# EAGLE schematic Power_FM (EAGLE 5.11)

## Sheet 1 of 10
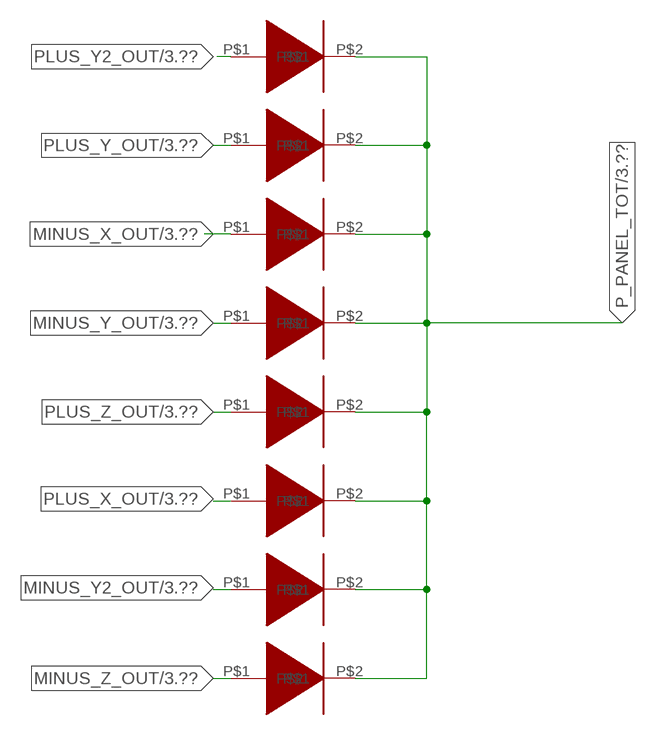
[diagram p0: schematic, sheet 1]

### Parts
D104  DIODE_FM  [DIODE_FM]
D105  DIODE_FM  [DIODE_FM]
D106  DIODE_FM  [DIODE_FM]
D107  DIODE_FM  [DIODE_FM]
D108  DIODE_FM  [DIODE_FM]
D109  DIODE_FM  [DIODE_FM]
D110  DIODE_FM  [DIODE_FM]
D111  DIODE_FM  [DIODE_FM]

### Nets
MINUS_X_OUT: D106.P$1 ; also sheet 3
MINUS_Y2_OUT: D110.P$1 ; also sheet 3
MINUS_Y_OUT: D107.P$1 ; also sheet 3
MINUS_Z_OUT: D111.P$1 ; also sheet 3
P_PANEL_TOT: D104.P$2 D105.P$2 D106.P$2 D107.P$2 D108.P$2 D109.P$2 D110.P$2 D111.P$2 ; also sheet 3
PLUS_X_OUT: D109.P$1 ; also sheet 3
PLUS_Y2_OUT: D104.P$1 ; also sheet 3
PLUS_Y_OUT: D105.P$1 ; also sheet 3
PLUS_Z_OUT: D108.P$1 ; also sheet 3

## Sheet 2 of 10
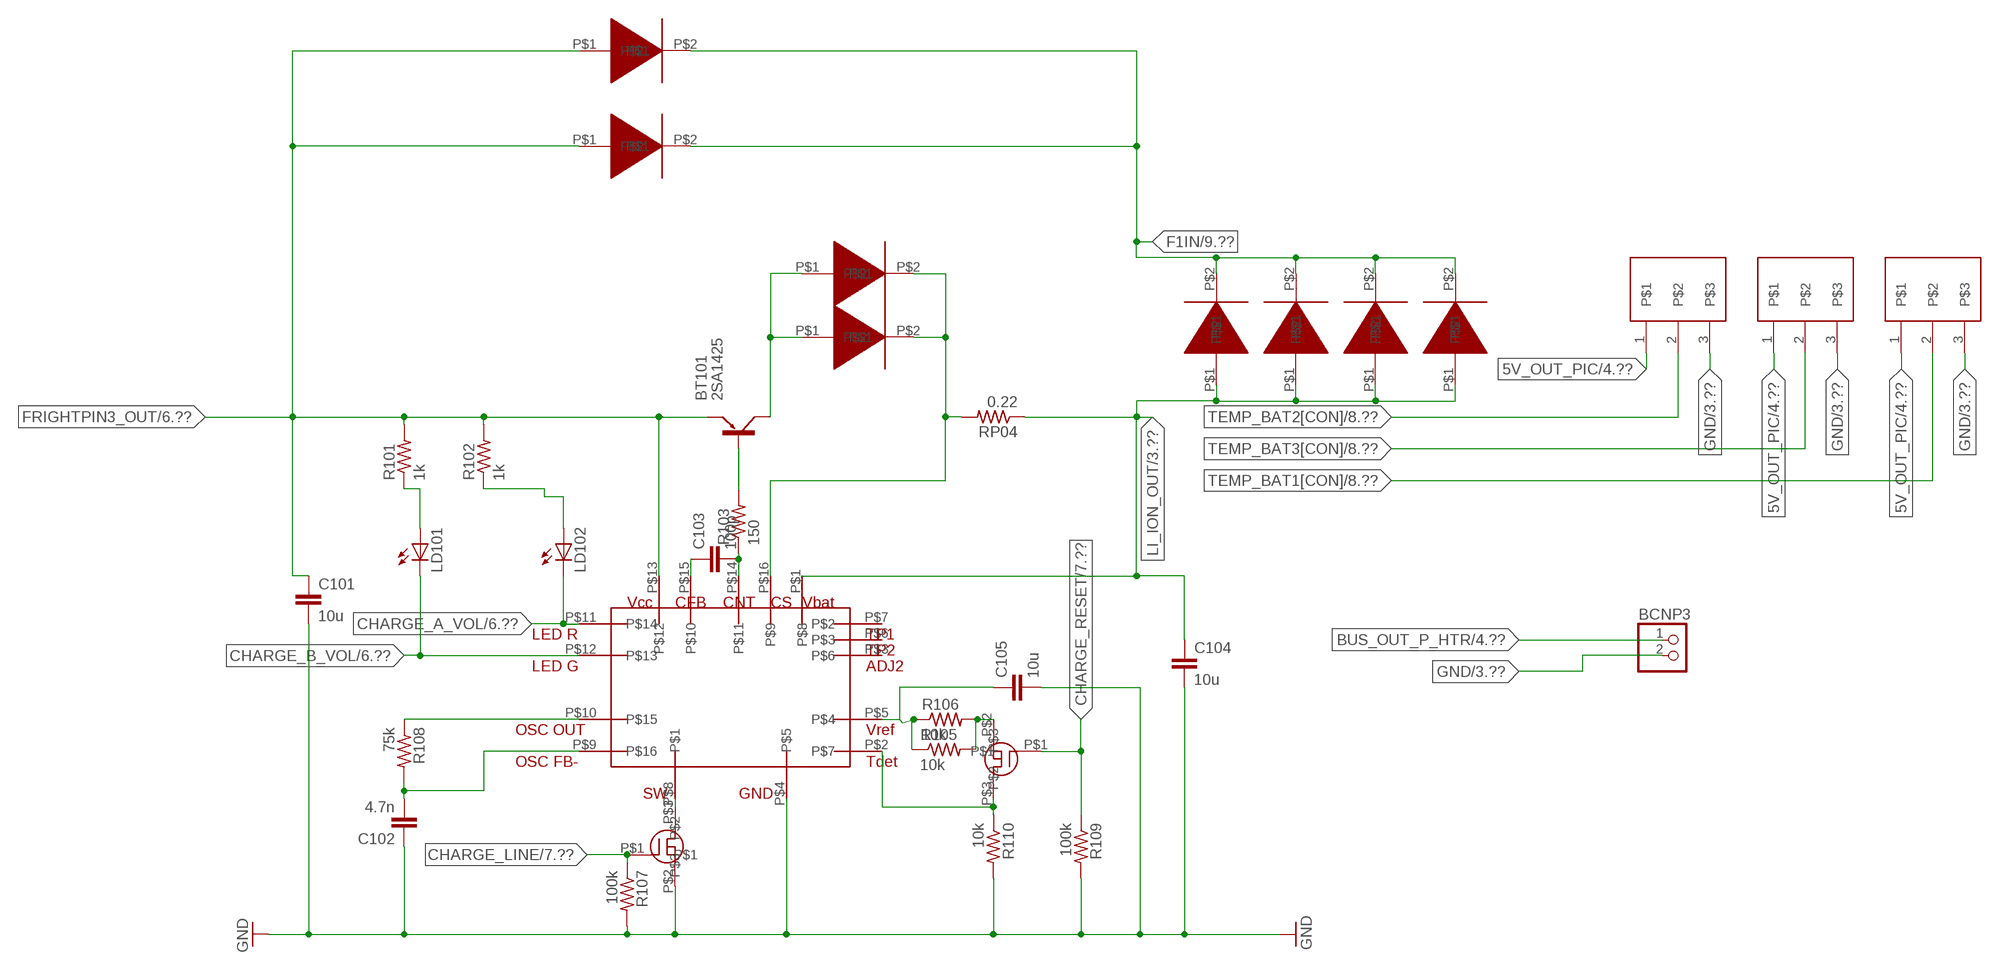
[diagram p1: schematic, sheet 2]

### Parts
BCNP3  PINHD-1X2  [1X02]
BCNP4  BAT_CON1  [BAT_CON1]
BCNP5  BAT_CON1  [BAT_CON1]
BCNP6  BAT_CON1  [BAT_CON1]
BT101  2SA1425  [2-7D101A]
C101  10u  C-EUC0603  [C0603]
C102  4.7n  C-EUC0603  [C0603]
C103  100p  C-EUC0603  [C0603]
C104  10u  C-EUC0603  [C0603]
C105  10u  C-EUC0603  [C0603]
CHARGE_IC  MM1639  [MM1639]
D101  DIODE_FM  [DIODE_FM]
D102  DIODE_FM  [DIODE_FM]
D103  DIODE_FM  [DIODE_FM]
D112  DIODE_FM  [DIODE_FM]
D114  DIODE_FM  [DIODE_FM]
D115  DIODE_FM  [DIODE_FM]
D116  DIODE_FM  [DIODE_FM]
D117  DIODE_FM  [DIODE_FM]
LD101  LED3MM  [LED3MM]
LD102  LED3MM  [LED3MM]
Q101  2SK1062  [2SK1062]
Q102  2SK1062  [2SK1062]
R101  1k  R-US_R0603  [R0603]
R102  1k  R-US_R0603  [R0603]
R103  150  R-US_R0603  [R0603]
R105  10k  R-US_R0603  [R0603]
R106  10k  R-US_R0603  [R0603]
R107  100k  R-US_R0603  [R0603]
R108  75k  R-US_R0603  [R0603]
R109  100k  R-US_R0603  [R0603]
R110  10k  R-US_R0603  [R0603]
RP04  0.22  R-US_0207/15  [0207/15]

### Nets
5V_OUT_PIC: BCNP4.1 BCNP5.1 BCNP6.1 ; also sheet 4,6,7,8,9
BUS_OUT_P_HTR: BCNP3.1 ; also sheet 4
CHARGE_A_VOL: CHARGE_IC.P$11 LD102.K(C) ; also sheet 6
CHARGE_B_VOL: CHARGE_IC.P$12 LD101.K(C) ; also sheet 6
CHARGE_LINE: Q101.P$1 R107.1 ; also sheet 7
CHARGE_RESET: Q102.P$1 R109.1 ; also sheet 7
F1IN: D103.P$2 D112.P$2 D114.P$2 D115.P$2 D116.P$2 D117.P$2 ; also sheet 9
FRIGHTPIN3_OUT: BT101.P$3(E) C101.1 CHARGE_IC.P$13 D103.P$1 D112.P$1 R101.2 R102.2 ; also sheet 6,9
GND: BCNP3.2 BCNP4.3 BCNP5.3 BCNP6.3 C101.2 C102.1 C104.2 C105.2 CHARGE_IC.P$4 Q101.P$2 R107.2 R109.2 R110.2 ; also sheet 3,4,5,6,7,8,9,10
LI_ION_OUT: C104.1 CHARGE_IC.P$1 D114.P$1 D115.P$1 D116.P$1 D117.P$1 RP04.1 ; also sheet 3
N$2: LD101.A R101.1
N$4: LD102.A R102.1
N$5: C102.2 CHARGE_IC.P$9 R108.2
N$6: CHARGE_IC.P$10 R108.1
N$8: CHARGE_IC.P$2 Q102.P$3 R110.1
N$9: C105.1 CHARGE_IC.P$5 R105.1 R106.1
N$10: Q102.P$2 R105.2 R106.2
N$12: BT101.P$2(C) D101.P$1 D102.P$1
N$13: C103.2 CHARGE_IC.P$14 R103.1
N$14: C103.1 CHARGE_IC.P$15
N$17: CHARGE_IC.P$8 Q101.P$3
N$19: CHARGE_IC.P$16 D101.P$2 D102.P$2 RP04.2
N$92: BT101.P$1(B) R103.2
TEMP_BAT1[CON]: BCNP5.2 ; also sheet 8
TEMP_BAT2[CON]: BCNP6.2 ; also sheet 8
TEMP_BAT3[CON]: BCNP4.2 ; also sheet 8
Unconnected: CHARGE_IC.P$3 CHARGE_IC.P$6 CHARGE_IC.P$7

## Sheet 3 of 10
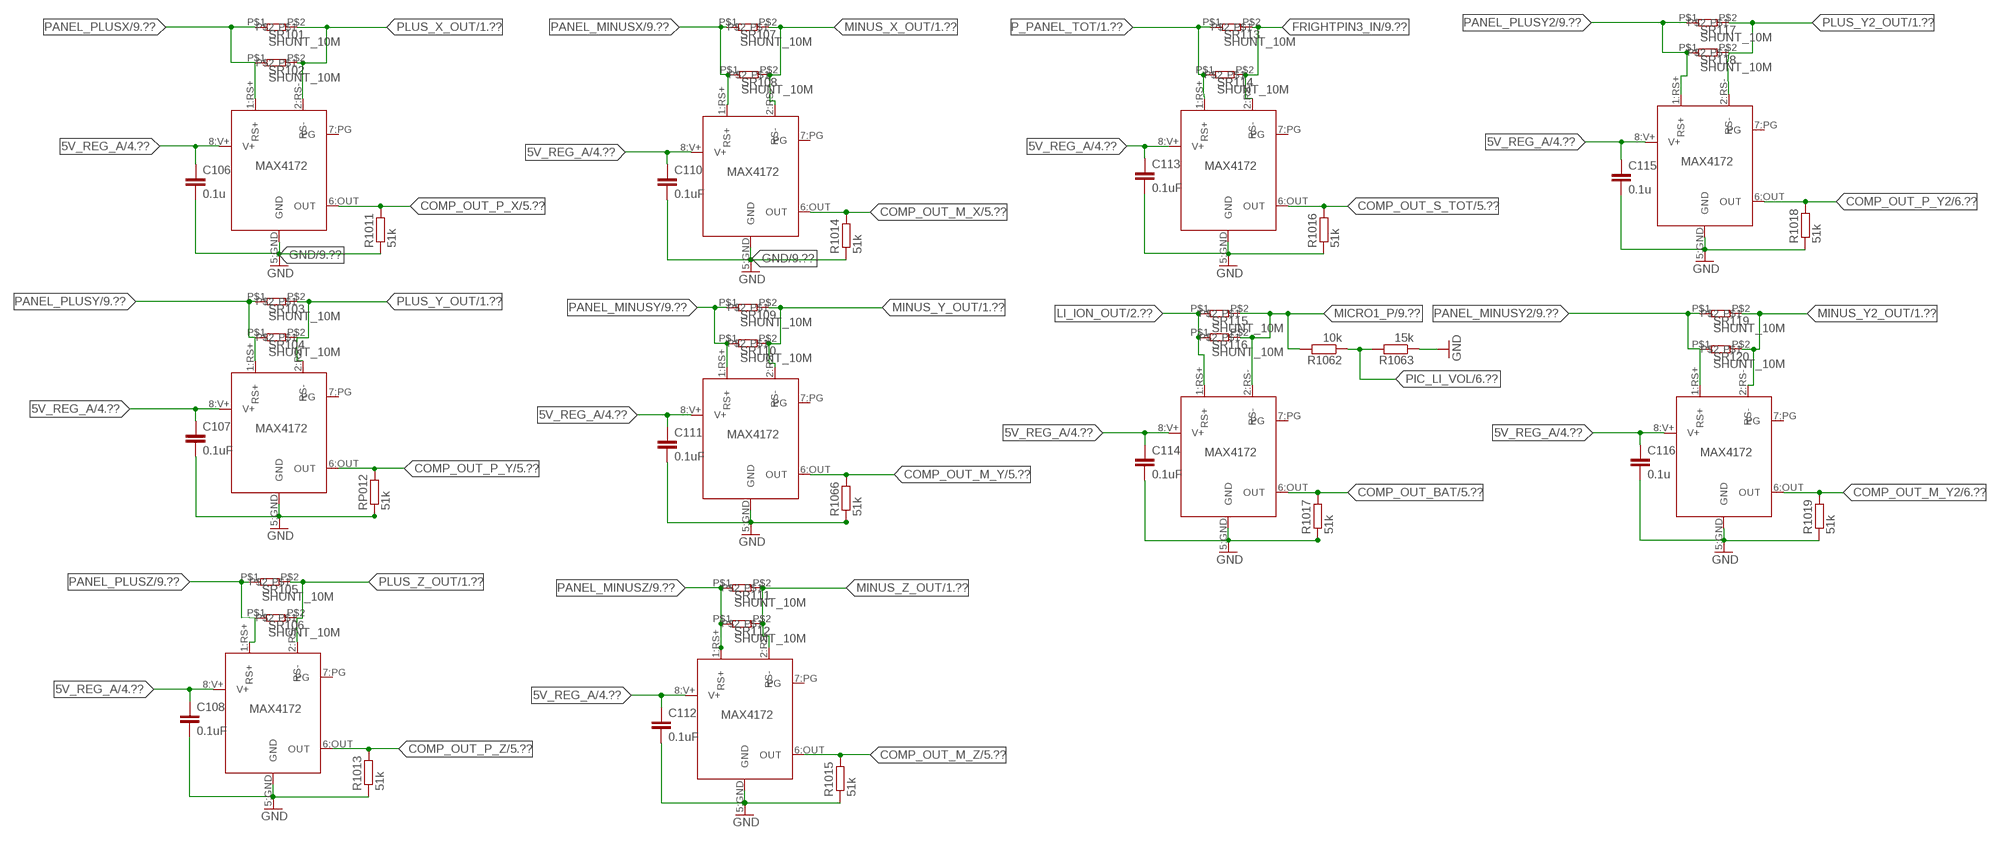
[diagram p2: schematic, sheet 3]

### Parts
C106  0.1u  C-EUC0603  [C0603]
C107  0.1uF  C-EUC0603  [C0603]
C108  0.1uF  C-EUC0603  [C0603]
C110  0.1uF  C-EUC0603  [C0603]
C111  0.1uF  C-EUC0603  [C0603]
C112  0.1uF  C-EUC0603  [C0603]
C113  0.1uF  C-EUC0603  [C0603]
C114  0.1uF  C-EUC0603  [C0603]
C115  0.1u  C-EUC0603  [C0603]
C116  0.1u  C-EUC0603  [C0603]
LI  MAX4172  [MAX4172]
M_X  MAX4172  [MAX4172]
M_Y  MAX4172  [MAX4172]
M_Y"  MAX4172  [MAX4172]
M_Z  MAX4172  [MAX4172]
P_X  MAX4172  [MAX4172]
P_Y  MAX4172  [MAX4172]
P_Y"  MAX4172  [MAX4172]
P_Z  MAX4172  [MAX4172]
R1011  51k  R-EU_R0603  [R0603]
R1013  51k  R-EU_R0603  [R0603]
R1014  51k  R-EU_R0603  [R0603]
R1015  51k  R-EU_R0603  [R0603]
R1016  51k  R-EU_R0603  [R0603]
R1017  51k  R-EU_R0603  [R0603]
R1018  51k  R-EU_R0603  [R0603]
R1019  51k  R-EU_R0603  [R0603]
R1062  10k  R-EU_R0603  [R0603]
R1063  15k  R-EU_R0603  [R0603]
R1066  51k  R-EU_R0603  [R0603]
RP012  51k  R-EU_R0603  [R0603]
SR101  SHUNT_10M  [SHUNT]
SR102  SHUNT_10M  [SHUNT]
SR103  SHUNT_10M  [SHUNT]
SR104  SHUNT_10M  [SHUNT]
SR105  SHUNT_10M  [SHUNT]
SR106  SHUNT_10M  [SHUNT]
SR107  SHUNT_10M  [SHUNT]
SR108  SHUNT_10M  [SHUNT]
SR109  SHUNT_10M  [SHUNT]
SR110  SHUNT_10M  [SHUNT]
SR111  SHUNT_10M  [SHUNT]
SR112  SHUNT_10M  [SHUNT]
SR113  SHUNT_10M  [SHUNT]
SR114  SHUNT_10M  [SHUNT]
SR115  SHUNT_10M  [SHUNT]
SR116  SHUNT_10M  [SHUNT]
SR117  SHUNT_10M  [SHUNT]
SR118  SHUNT_10M  [SHUNT]
SR119  SHUNT_10M  [SHUNT]
SR120  SHUNT_10M  [SHUNT]
TOT  MAX4172  [MAX4172]

### Nets
5V_REG_A: C106.1 C107.1 C108.1 C110.1 C111.1 C112.1 C113.1 C114.1 C115.1 C116.1 LI.8:V+(V+) M_X.8:V+(V+) M_Y".8:V+(V+) M_Y.8:V+(V+) M_Z.8:V+(V+) P_X.8:V+(V+) P_Y".8:V+(V+) P_Y.8:V+(V+) P_Z.8:V+(V+) TOT.8:V+(V+) ; also sheet 4,5,6,7,10
COMP_OUT_BAT: LI.6:OUT(OUT) R1017.2 ; also sheet 5
COMP_OUT_M_X: M_X.6:OUT(OUT) R1014.2 ; also sheet 5
COMP_OUT_M_Y: M_Y.6:OUT(OUT) R1066.2 ; also sheet 5
COMP_OUT_M_Y2: M_Y".6:OUT(OUT) R1019.2 ; also sheet 6
COMP_OUT_M_Z: M_Z.6:OUT(OUT) R1015.2 ; also sheet 5
COMP_OUT_P_X: P_X.6:OUT(OUT) R1011.2 ; also sheet 5
COMP_OUT_P_Y: P_Y.6:OUT(OUT) RP012.2 ; also sheet 5
COMP_OUT_P_Y2: P_Y".6:OUT(OUT) R1018.2 ; also sheet 6
COMP_OUT_P_Z: P_Z.6:OUT(OUT) R1013.2 ; also sheet 5
COMP_OUT_S_TOT: R1016.2 TOT.6:OUT(OUT) ; also sheet 5
FRIGHTPIN3_IN: SR113.P$2 SR114.P$2 TOT.2:RS-(RS-) ; also sheet 9
GND: C106.2 C107.2 C108.2 C110.2 C111.2 C112.2 C113.2 C114.2 C115.2 C116.2 LI.5:GND(GND) M_X.5:GND(GND) M_Y".5:GND(GND) M_Y.5:GND(GND) M_Z.5:GND(GND) P_X.5:GND(GND) P_Y".5:GND(GND) P_Y.5:GND(GND) P_Z.5:GND(GND) R1011.1 R1013.1 R1014.1 R1015.1 R1016.1 R1017.1 R1018.1 R1019.1 R1063.1 R1066.1 RP012.1 TOT.5:GND(GND) ; also sheet 2,4,5,6,7,8,9,10
LI_ION_OUT: LI.1:RS+(RS+) SR115.P$1 SR116.P$1 ; also sheet 2
MICRO1_P: LI.2:RS-(RS-) R1062.2 SR115.P$2 SR116.P$2 ; also sheet 9
MINUS_X_OUT: M_X.2:RS-(RS-) SR107.P$2 SR108.P$2 ; also sheet 1
MINUS_Y2_OUT: M_Y".2:RS-(RS-) SR119.P$2 SR120.P$2 ; also sheet 1
MINUS_Y_OUT: M_Y.2:RS-(RS-) SR109.P$2 SR110.P$2 ; also sheet 1
MINUS_Z_OUT: M_Z.2:RS-(RS-) SR111.P$2 SR112.P$2 ; also sheet 1
P_PANEL_TOT: SR113.P$1 SR114.P$1 TOT.1:RS+(RS+) ; also sheet 1
PANEL_MINUSX: M_X.1:RS+(RS+) SR107.P$1 SR108.P$1 ; also sheet 9
PANEL_MINUSY: M_Y.1:RS+(RS+) SR109.P$1 SR110.P$1 ; also sheet 9
PANEL_MINUSY2: M_Y".1:RS+(RS+) SR119.P$1 SR120.P$1 ; also sheet 9
PANEL_MINUSZ: M_Z.1:RS+(RS+) SR111.P$1 SR112.P$1 ; also sheet 9
PANEL_PLUSX: P_X.1:RS+(RS+) SR101.P$1 SR102.P$1 ; also sheet 9
PANEL_PLUSY: P_Y.1:RS+(RS+) SR103.P$1 SR104.P$1 ; also sheet 9
PANEL_PLUSY2: P_Y".1:RS+(RS+) SR117.P$1 SR118.P$1 ; also sheet 9
PANEL_PLUSZ: P_Z.1:RS+(RS+) SR105.P$1 SR106.P$1 ; also sheet 9
PIC_LI_VOL: R1062.1 R1063.2 ; also sheet 6
PLUS_X_OUT: P_X.2:RS-(RS-) SR101.P$2 SR102.P$2 ; also sheet 1
PLUS_Y2_OUT: P_Y".2:RS-(RS-) SR117.P$2 SR118.P$2 ; also sheet 1
PLUS_Y_OUT: P_Y.2:RS-(RS-) SR103.P$2 SR104.P$2 ; also sheet 1
PLUS_Z_OUT: P_Z.2:RS-(RS-) SR105.P$2 SR106.P$2 ; also sheet 1
Unconnected: LI.7:PG(PG) M_X.7:PG(PG) M_Y".7:PG(PG) M_Y.7:PG(PG) M_Z.7:PG(PG) P_X.7:PG(PG) P_Y".7:PG(PG) P_Y.7:PG(PG) P_Z.7:PG(PG) TOT.7:PG(PG)

## Sheet 4 of 10
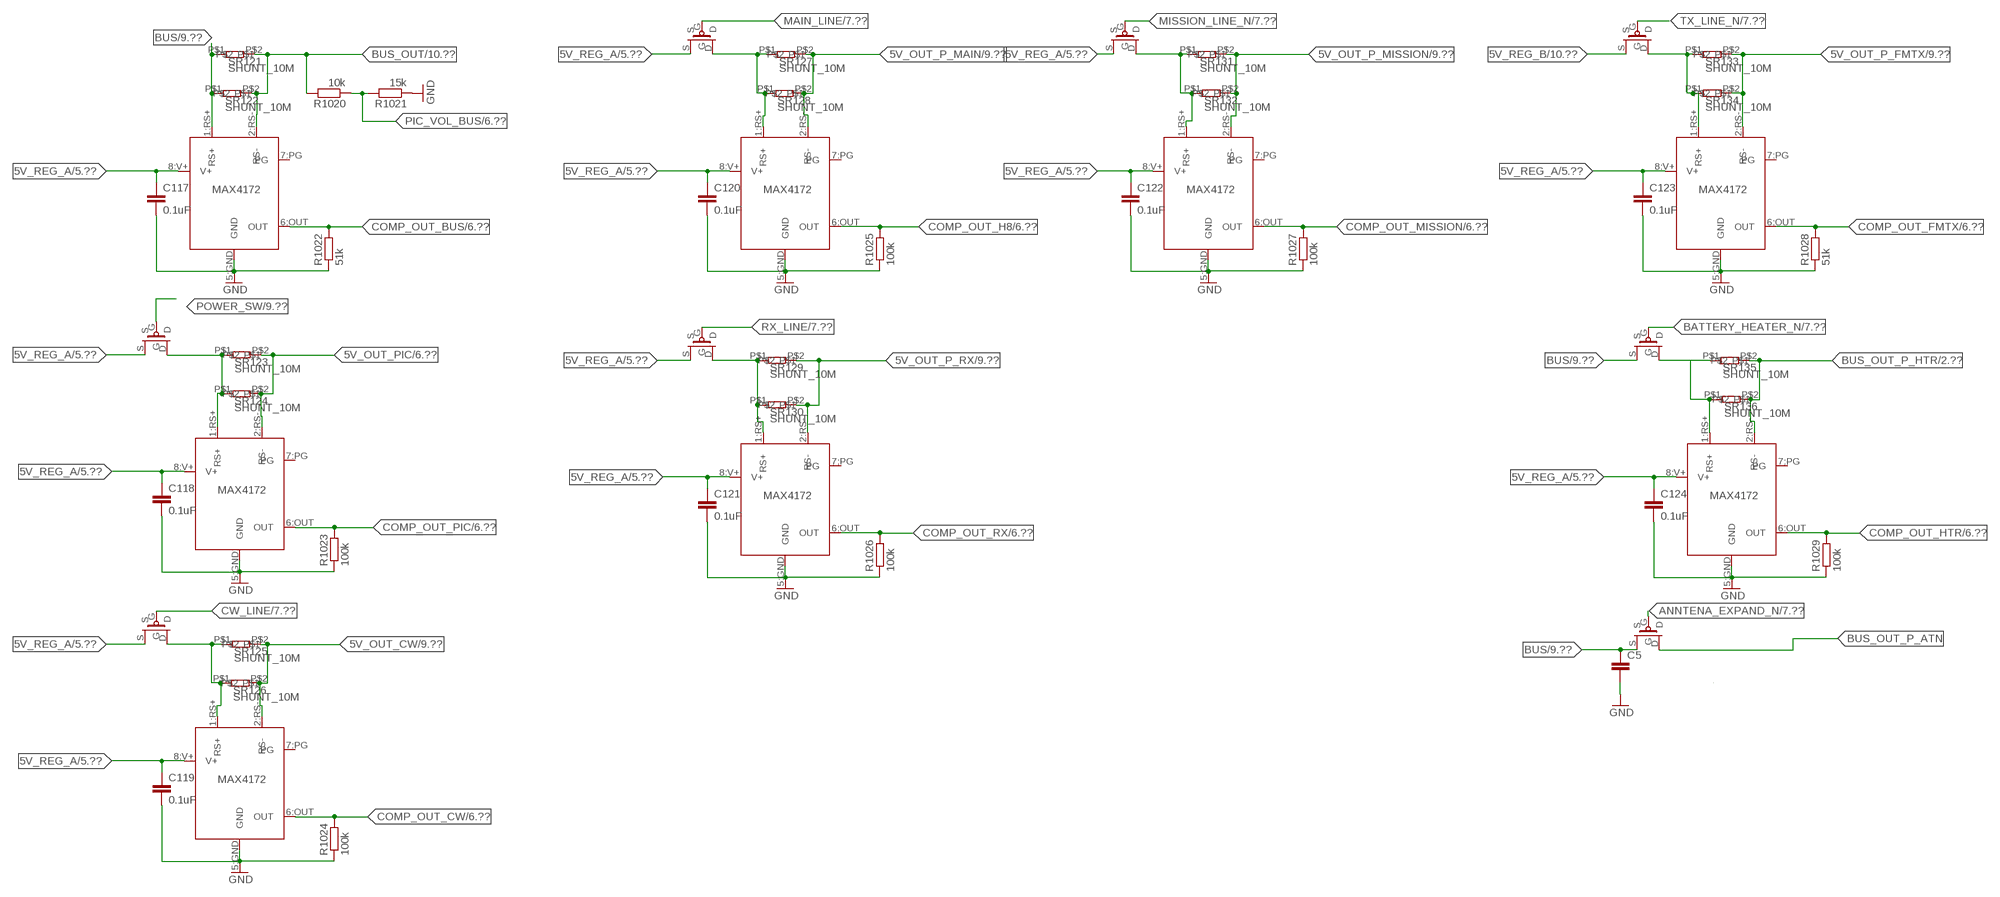
[diagram p3: schematic, sheet 4]

### Parts
C5  C-EUC1210  [C1210]
C117  0.1uF  C-EUC0603  [C0603]
C118  0.1uF  C-EUC0603  [C0603]
C119  0.1uF  C-EUC0603  [C0603]
C120  0.1uF  C-EUC0603  [C0603]
C121  0.1uF  C-EUC0603  [C0603]
C122  0.1uF  C-EUC0603  [C0603]
C123  0.1uF  C-EUC0603  [C0603]
C124  0.1uF  C-EUC0603  [C0603]
P_CW  MAX4172  [MAX4172]
P_H8  MAX4172  [MAX4172]
P_HTR  MAX4172  [MAX4172]
P_MISSION  MAX4172  [MAX4172]
P_PIC  MAX4172  [MAX4172]
P_REG  MAX4172  [MAX4172]
P_RX  MAX4172  [MAX4172]
P_TX  MAX4172  [MAX4172]
Q103  2SJ377  [2SJ377]
Q104  2SJ377  [2SJ377]
Q105  2SJ377  [2SJ377]
Q106  2SJ377  [2SJ377]
Q107  2SJ377  [2SJ377]
Q109  2SJ377  [2SJ377]
Q110  2SJ377  [2SJ377]
QP08  2SJ377  [2SJ377]
R1020  10k  R-EU_R0603  [R0603]
R1021  15k  R-EU_R0603  [R0603]
R1022  51k  R-EU_R0603  [R0603]
R1023  100k  R-EU_R0603  [R0603]
R1024  100k  R-EU_R0603  [R0603]
R1025  100k  R-EU_R0603  [R0603]
R1026  100k  R-EU_R0603  [R0603]
R1027  100k  R-EU_R0603  [R0603]
R1028  51k  R-EU_R0603  [R0603]
R1029  100k  R-EU_R0603  [R0603]
SR121  SHUNT_10M  [SHUNT]
SR122  SHUNT_10M  [SHUNT]
SR123  SHUNT_10M  [SHUNT]
SR124  SHUNT_10M  [SHUNT]
SR125  SHUNT_10M  [SHUNT]
SR126  SHUNT_10M  [SHUNT]
SR127  SHUNT_10M  [SHUNT]
SR128  SHUNT_10M  [SHUNT]
SR129  SHUNT_10M  [SHUNT]
SR130  SHUNT_10M  [SHUNT]
SR131  SHUNT_10M  [SHUNT]
SR132  SHUNT_10M  [SHUNT]
SR133  SHUNT_10M  [SHUNT]
SR134  SHUNT_10M  [SHUNT]
SR135  SHUNT_10M  [SHUNT]
SR136  SHUNT_10M  [SHUNT]

### Nets
5V_OUT_CW: P_CW.2:RS-(RS-) SR125.P$2 SR126.P$2 ; also sheet 9
5V_OUT_P_FMTX: P_TX.2:RS-(RS-) SR133.P$2 SR134.P$2 ; also sheet 9
5V_OUT_P_MAIN: P_H8.2:RS-(RS-) SR127.P$2 SR128.P$2 ; also sheet 9
5V_OUT_P_MISSION: P_MISSION.2:RS-(RS-) SR131.P$2 SR132.P$2 ; also sheet 9
5V_OUT_P_RX: P_RX.2:RS-(RS-) SR129.P$2 SR130.P$2 ; also sheet 9
5V_OUT_PIC: P_PIC.2:RS-(RS-) SR123.P$2 SR124.P$2 ; also sheet 2,6,7,8,9
5V_REG_A: C117.1 C118.1 C119.1 C120.1 C121.1 C122.1 C123.1 C124.1 P_CW.8:V+(V+) P_H8.8:V+(V+) P_HTR.8:V+(V+) P_MISSION.8:V+(V+) P_PIC.8:V+(V+) P_REG.8:V+(V+) P_RX.8:V+(V+) P_TX.8:V+(V+) Q103.S Q104.S Q105.S Q106.S Q107.S ; also sheet 3,5,6,7,10
5V_REG_B: QP08.S ; also sheet 10
ANNTENA_EXPAND_N: Q110.G ; also sheet 7
BATTERY_HEATER_N: Q109.G ; also sheet 7
BUS: C5.1 P_REG.1:RS+(RS+) Q109.S Q110.S SR121.P$1 SR122.P$1 ; also sheet 9
BUS_OUT: P_REG.2:RS-(RS-) R1020.2 SR121.P$2 SR122.P$2 ; also sheet 10
BUS_OUT_P_ATN: Q110.D
BUS_OUT_P_HTR: P_HTR.2:RS-(RS-) SR135.P$2 SR136.P$2 ; also sheet 2
COMP_OUT_BUS: P_REG.6:OUT(OUT) R1022.2 ; also sheet 6
COMP_OUT_CW: P_CW.6:OUT(OUT) R1024.2 ; also sheet 6
COMP_OUT_FMTX: P_TX.6:OUT(OUT) R1028.2 ; also sheet 6
COMP_OUT_H8: P_H8.6:OUT(OUT) R1025.2 ; also sheet 6
COMP_OUT_HTR: P_HTR.6:OUT(OUT) R1029.2 ; also sheet 6
COMP_OUT_MISSION: P_MISSION.6:OUT(OUT) R1027.2 ; also sheet 6
COMP_OUT_PIC: P_PIC.6:OUT(OUT) R1023.2 ; also sheet 6
COMP_OUT_RX: P_RX.6:OUT(OUT) R1026.2 ; also sheet 6
CW_LINE: Q104.G ; also sheet 7
GND: C5.2 C117.2 C118.2 C119.2 C120.2 C121.2 C122.2 C123.2 C124.2 P_CW.5:GND(GND) P_H8.5:GND(GND) P_HTR.5:GND(GND) P_MISSION.5:GND(GND) P_PIC.5:GND(GND) P_REG.5:GND(GND) P_RX.5:GND(GND) P_TX.5:GND(GND) R1021.1 R1022.1 R1023.1 R1024.1 R1025.1 R1026.1 R1027.1 R1028.1 R1029.1 ; also sheet 2,3,5,6,7,8,9,10
MAIN_LINE: Q105.G ; also sheet 7
MISSION_LINE_N: Q107.G ; also sheet 7
N$3: P_PIC.1:RS+(RS+) Q103.D SR123.P$1 SR124.P$1
N$55: P_HTR.1:RS+(RS+) Q109.D SR135.P$1 SR136.P$1
N$56: P_CW.1:RS+(RS+) Q104.D SR125.P$1 SR126.P$1
N$70: P_H8.1:RS+(RS+) Q105.D SR127.P$1 SR128.P$1
N$77: P_RX.1:RS+(RS+) Q106.D SR129.P$1 SR130.P$1
N$91: P_MISSION.1:RS+(RS+) Q107.D SR131.P$1 SR132.P$1
N$98: P_TX.1:RS+(RS+) QP08.D SR133.P$1 SR134.P$1
PIC_VOL_BUS: R1020.1 R1021.2 ; also sheet 6
POWER_SW: Q103.G ; also sheet 9
RX_LINE: Q106.G ; also sheet 7
TX_LINE_N: QP08.G ; also sheet 7
Unconnected: P_CW.7:PG(PG) P_H8.7:PG(PG) P_HTR.7:PG(PG) P_MISSION.7:PG(PG) P_PIC.7:PG(PG) P_REG.7:PG(PG) P_RX.7:PG(PG) P_TX.7:PG(PG)

## Sheet 5 of 10
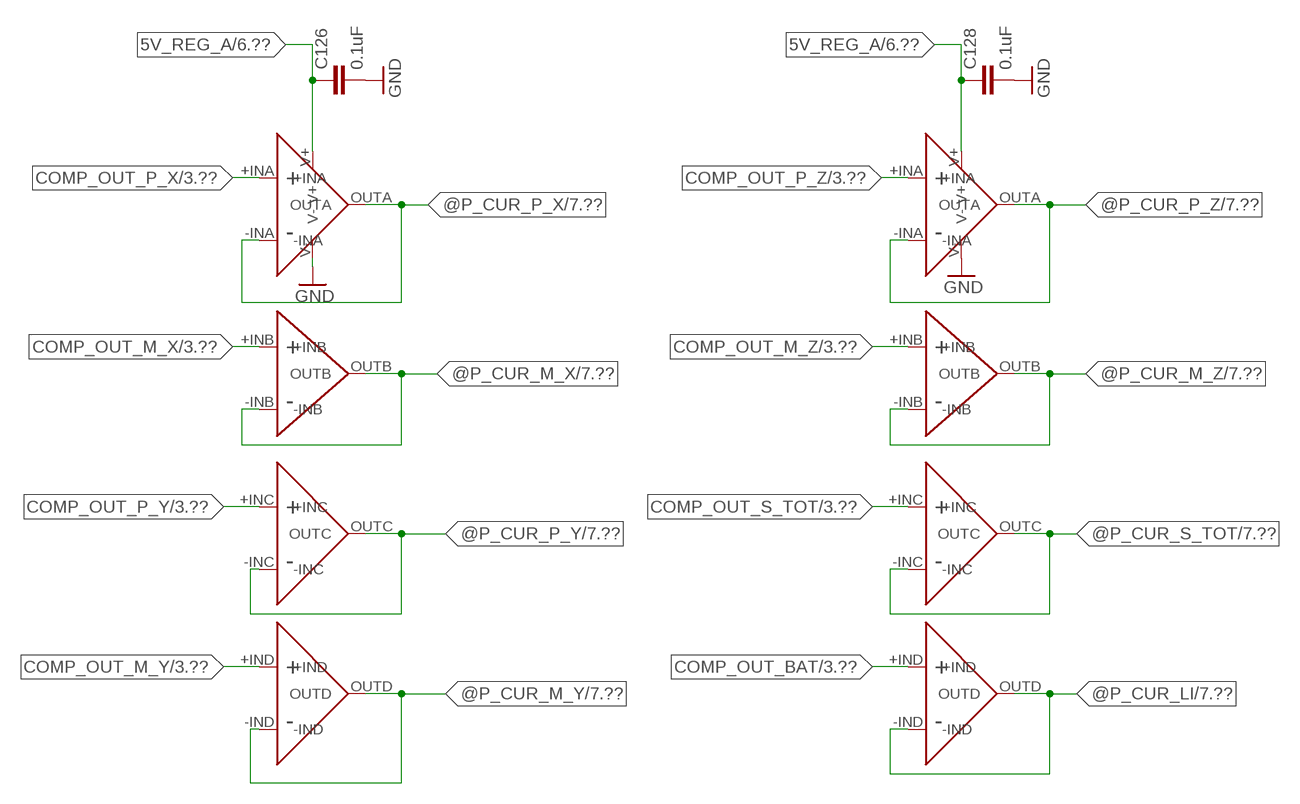
[diagram p4: schematic, sheet 5]

### Parts
AMP101  AD8554ARUZ  [AD8554ARUZ]
AMP102  AD8554ARUZ  [AD8554ARUZ]
C126  0.1uF  C-EUC0603  [C0603]
C128  0.1uF  C-EUC0603  [C0603]

### Nets
5V_REG_A: AMP101.V+ AMP102.V+ C126.1 C128.1 ; also sheet 3,4,6,7,10
@P_CUR_LI: AMP102.-IND AMP102.OUTD ; also sheet 7
@P_CUR_M_X: AMP101.-INB AMP101.OUTB ; also sheet 7
@P_CUR_M_Y: AMP101.-IND AMP101.OUTD ; also sheet 7
@P_CUR_M_Z: AMP102.-INB AMP102.OUTB ; also sheet 7
@P_CUR_P_X: AMP101.-INA AMP101.OUTA ; also sheet 7
@P_CUR_P_Y: AMP101.-INC AMP101.OUTC ; also sheet 7
@P_CUR_P_Z: AMP102.-INA AMP102.OUTA ; also sheet 7
@P_CUR_S_TOT: AMP102.-INC AMP102.OUTC ; also sheet 7
COMP_OUT_BAT: AMP102.+IND ; also sheet 3
COMP_OUT_M_X: AMP101.+INB ; also sheet 3
COMP_OUT_M_Y: AMP101.+IND ; also sheet 3
COMP_OUT_M_Z: AMP102.+INB ; also sheet 3
COMP_OUT_P_X: AMP101.+INA ; also sheet 3
COMP_OUT_P_Y: AMP101.+INC ; also sheet 3
COMP_OUT_P_Z: AMP102.+INA ; also sheet 3
COMP_OUT_S_TOT: AMP102.+INC ; also sheet 3
GND: AMP101.V- AMP102.V- C126.2 C128.2 ; also sheet 2,3,4,6,7,8,9,10

## Sheet 6 of 10
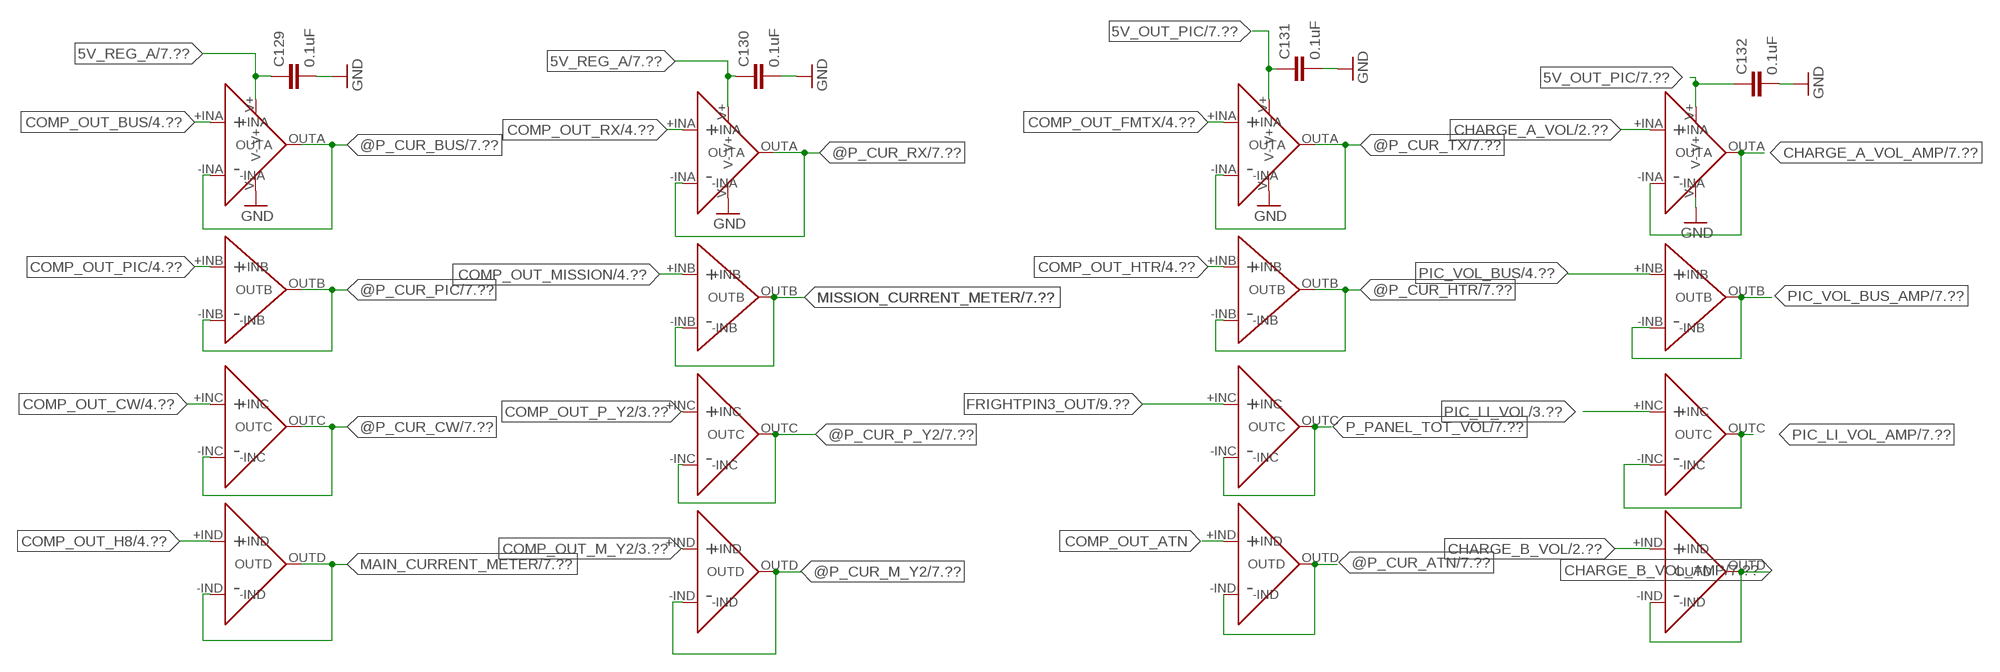
[diagram p5: schematic, sheet 6]

### Parts
AMP103  AD8554ARUZ  [AD8554ARUZ]
AMP104  AD8554ARUZ  [AD8554ARUZ]
AMP105  AD8554ARUZ  [AD8554ARUZ]
AMP106  AD8554ARUZ  [AD8554ARUZ]
C129  0.1uF  C-EUC0603  [C0603]
C130  0.1uF  C-EUC0603  [C0603]
C131  0.1uF  C-EUC0603  [C0603]
C132  0.1uF  C-EUC0603  [C0603]

### Nets
5V_OUT_PIC: AMP105.V+ AMP106.V+ C131.1 C132.1 ; also sheet 2,4,7,8,9
5V_REG_A: AMP103.V+ AMP104.V+ C129.1 C130.1 ; also sheet 3,4,5,7,10
@P_CUR_ATN: AMP105.-IND AMP105.OUTD ; also sheet 7
@P_CUR_BUS: AMP103.-INA AMP103.OUTA ; also sheet 7
@P_CUR_CW: AMP103.-INC AMP103.OUTC ; also sheet 7
@P_CUR_HTR: AMP105.-INB AMP105.OUTB ; also sheet 7
@P_CUR_M_Y2: AMP104.-IND AMP104.OUTD ; also sheet 7
@P_CUR_P_Y2: AMP104.-INC AMP104.OUTC ; also sheet 7
@P_CUR_PIC: AMP103.-INB AMP103.OUTB ; also sheet 7,9
@P_CUR_RX: AMP104.-INA AMP104.OUTA ; also sheet 7
@P_CUR_TX: AMP105.-INA AMP105.OUTA ; also sheet 7
CHARGE_A_VOL: AMP106.+INA ; also sheet 2
CHARGE_A_VOL_AMP: AMP106.-INA AMP106.OUTA ; also sheet 7
CHARGE_B_VOL: AMP106.+IND ; also sheet 2
CHARGE_B_VOL_AMP: AMP106.-IND AMP106.OUTD ; also sheet 7
COMP_OUT_ATN: AMP105.+IND
COMP_OUT_BUS: AMP103.+INA ; also sheet 4
COMP_OUT_CW: AMP103.+INC ; also sheet 4
COMP_OUT_FMTX: AMP105.+INA ; also sheet 4
COMP_OUT_H8: AMP103.+IND ; also sheet 4
COMP_OUT_HTR: AMP105.+INB ; also sheet 4
COMP_OUT_M_Y2: AMP104.+IND ; also sheet 3
COMP_OUT_MISSION: AMP104.+INB ; also sheet 4
COMP_OUT_P_Y2: AMP104.+INC ; also sheet 3
COMP_OUT_PIC: AMP103.+INB ; also sheet 4
COMP_OUT_RX: AMP104.+INA ; also sheet 4
FRIGHTPIN3_OUT: AMP105.+INC ; also sheet 2,9
GND: AMP103.V- AMP104.V- AMP105.V- AMP106.V- C129.2 C130.2 C131.2 C132.2 ; also sheet 2,3,4,5,7,8,9,10
MAIN_CURRENT_METER: AMP103.-IND AMP103.OUTD ; also sheet 7
MISSION_CURRENT_METER: AMP104.-INB AMP104.OUTB ; also sheet 7
P_PANEL_TOT_VOL: AMP105.-INC AMP105.OUTC ; also sheet 7
PIC_LI_VOL: AMP106.+INC ; also sheet 3
PIC_LI_VOL_AMP: AMP106.-INC AMP106.OUTC ; also sheet 7
PIC_VOL_BUS: AMP106.+INB ; also sheet 4
PIC_VOL_BUS_AMP: AMP106.-INB AMP106.OUTB ; also sheet 7

## Sheet 7 of 10
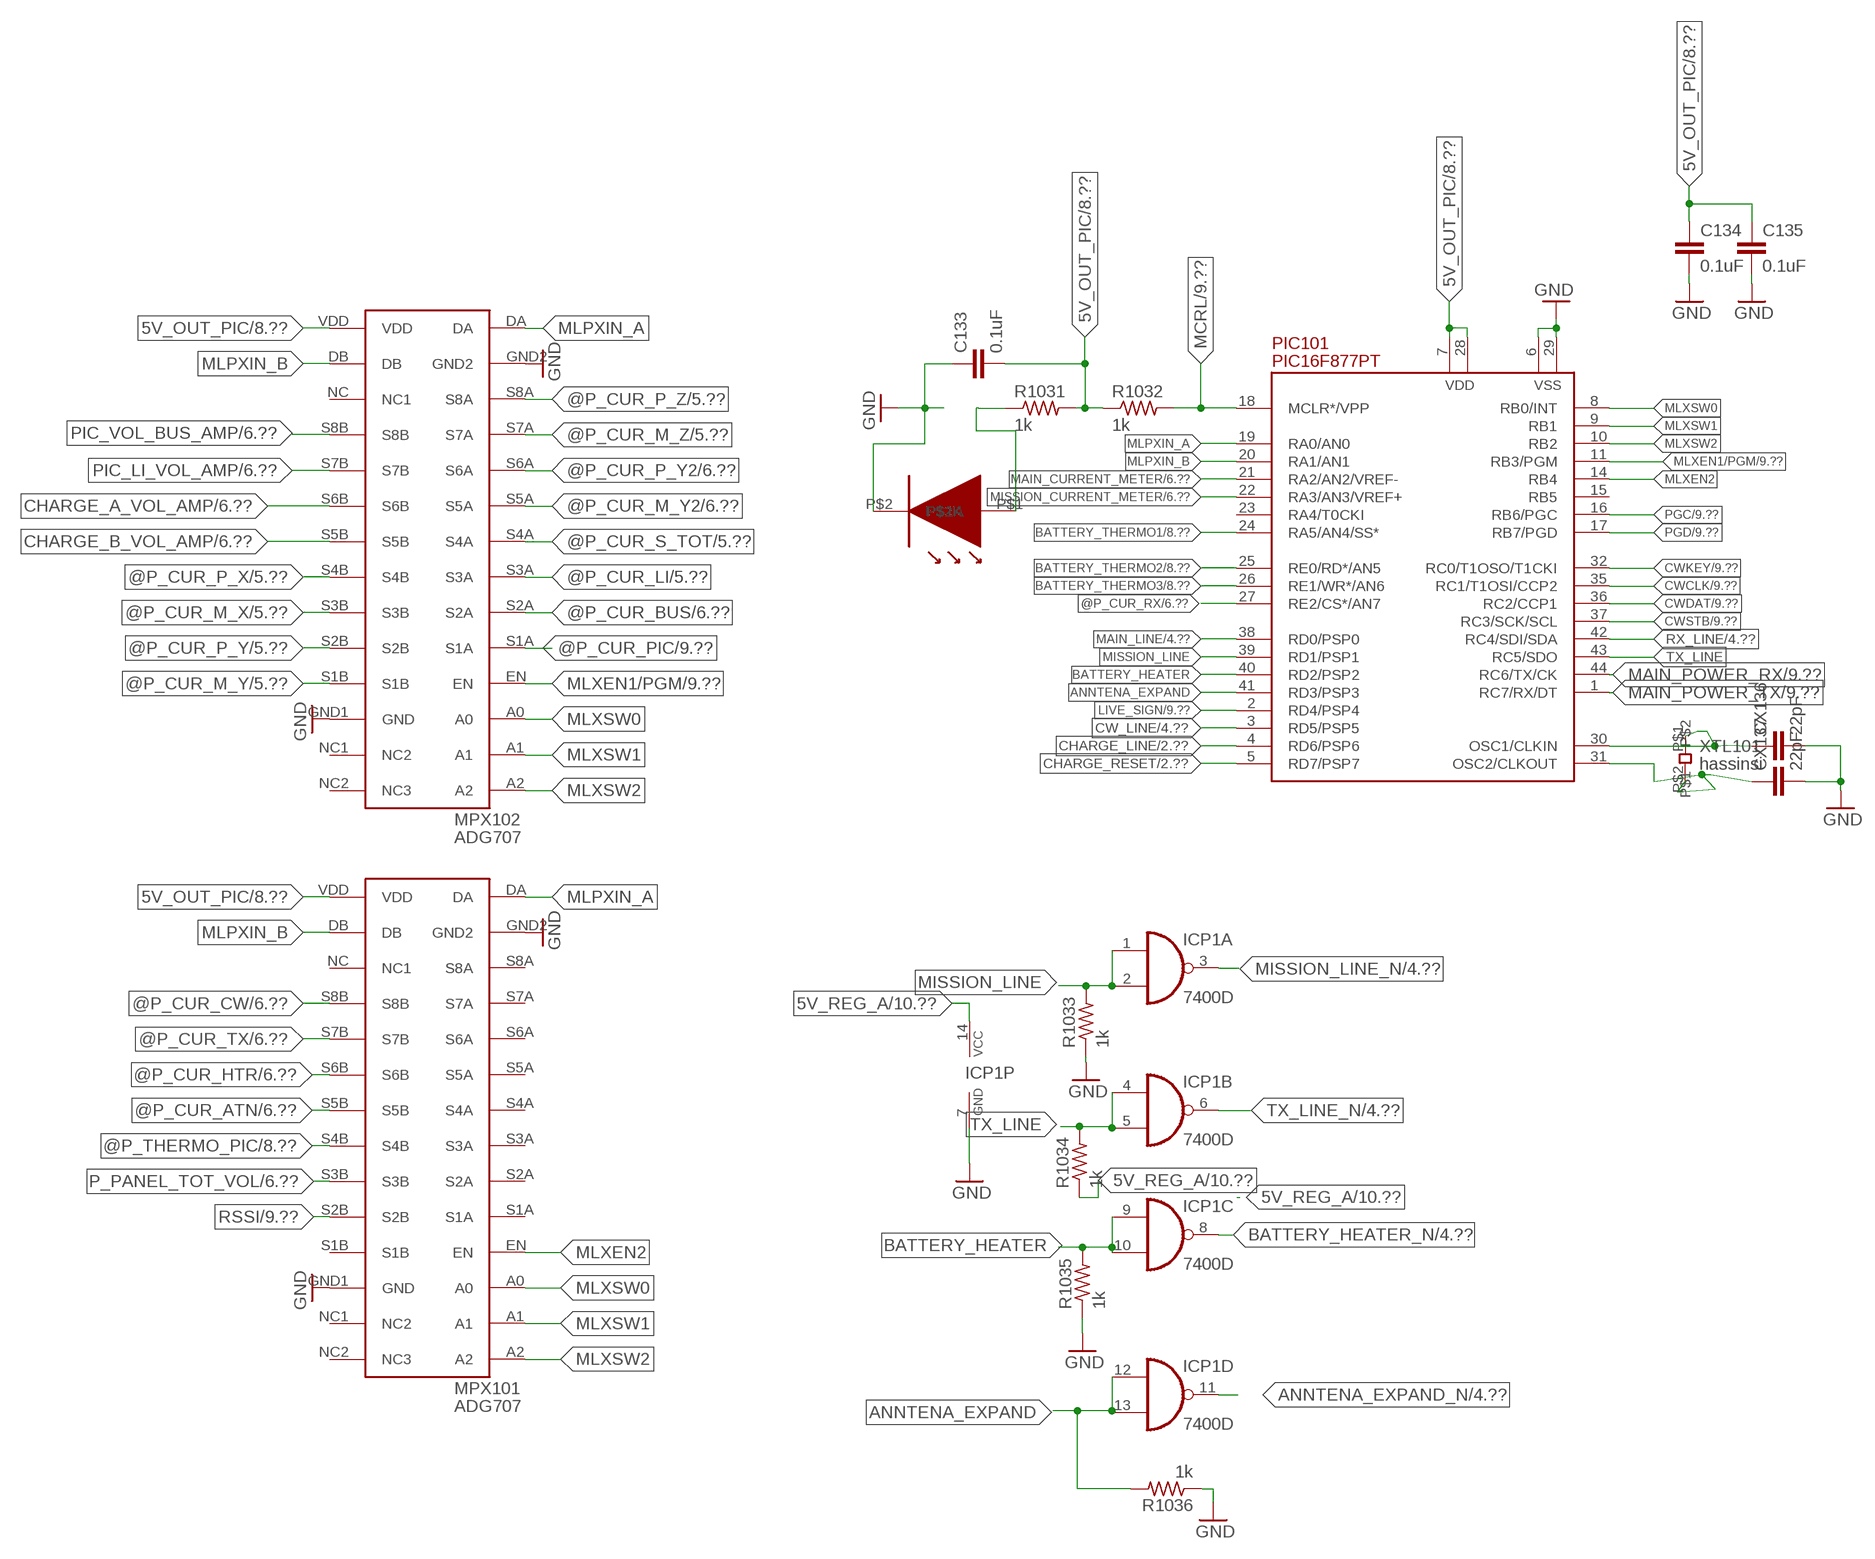
[diagram p6: schematic, sheet 7]

### Parts
C133  0.1uF  C-EUC0603  [C0603]
C134  0.1uF  C-EUC0603  [C0603]
C135  0.1uF  C-EUC0603  [C0603]
CX136  22pF  C-EUC0805  [C0805]
CX137  22pF  C-EUC0805  [C0805]
ICP1  7400D  [SO14]
LD103  SML-21X  [LED_CHIP]
MPX101  ADG707  [ADG707]
MPX102  ADG707  [ADG707]
PIC101  PIC16F877PT  [TQFP44]
R1031  1k  R-US_R0603  [R0603]
R1032  1k  R-US_R0603  [R0603]
R1033  1k  R-US_R0603  [R0603]
R1034  1k  R-US_R0603  [R0603]
R1035  1k  R-US_R0603  [R0603]
R1036  1k  R-US_R0603  [R0603]
XTL101  hassinsi  NX8045GB  [SUISYOU]

### Nets
5V_OUT_PIC: C133.2 C134.1 C135.1 MPX101.VDD MPX102.VDD PIC101.7(VDD) PIC101.28(VDD) R1031.2 R1032.1 ; also sheet 2,4,6,8,9
5V_REG_A: ICP1.14(P:VCC) R1034.1 ; also sheet 3,4,5,6,10
@P_CUR_ATN: MPX101.S5B ; also sheet 6
@P_CUR_BUS: MPX102.S2A ; also sheet 6
@P_CUR_CW: MPX101.S8B ; also sheet 6
@P_CUR_HTR: MPX101.S6B ; also sheet 6
@P_CUR_LI: MPX102.S3A ; also sheet 5
@P_CUR_M_X: MPX102.S3B ; also sheet 5
@P_CUR_M_Y: MPX102.S1B ; also sheet 5
@P_CUR_M_Y2: MPX102.S5A ; also sheet 6
@P_CUR_M_Z: MPX102.S7A ; also sheet 5
@P_CUR_P_X: MPX102.S4B ; also sheet 5
@P_CUR_P_Y: MPX102.S2B ; also sheet 5
@P_CUR_P_Y2: MPX102.S6A ; also sheet 6
@P_CUR_P_Z: MPX102.S8A ; also sheet 5
@P_CUR_PIC: MPX102.S1A ; also sheet 6,9
@P_CUR_RX: PIC101.27(RE2/CS*/AN7) ; also sheet 6
@P_CUR_S_TOT: MPX102.S4A ; also sheet 5
@P_CUR_TX: MPX101.S7B ; also sheet 6
@P_THERMO_PIC: MPX101.S4B ; also sheet 8
ANNTENA_EXPAND: ICP1.12(D:I0) ICP1.13(D:I1) PIC101.41(RD3/PSP3) R1036.2
ANNTENA_EXPAND_N: ICP1.11(D:O) ; also sheet 4
BATTERY_HEATER: ICP1.9(C:I0) ICP1.10(C:I1) PIC101.40(RD2/PSP2) R1035.2
BATTERY_HEATER_N: ICP1.8(C:O) ; also sheet 4
BATTERY_THERMO1: PIC101.24(RA5/AN4/SS*) ; also sheet 8
BATTERY_THERMO2: PIC101.25(RE0/RD*/AN5) ; also sheet 8
BATTERY_THERMO3: PIC101.26(RE1/WR*/AN6) ; also sheet 8
CHARGE_A_VOL_AMP: MPX102.S6B ; also sheet 6
CHARGE_B_VOL_AMP: MPX102.S5B ; also sheet 6
CHARGE_LINE: PIC101.4(RD6/PSP6) ; also sheet 2
CHARGE_RESET: PIC101.5(RD7/PSP7) ; also sheet 2
CW_LINE: PIC101.3(RD5/PSP5) ; also sheet 4
CWCLK: PIC101.35(RC1/T1OSI/CCP2) ; also sheet 9
CWDAT: PIC101.36(RC2/CCP1) ; also sheet 9
CWKEY: PIC101.32(RC0/T1OSO/T1CKI) ; also sheet 9
CWSTB: PIC101.37(RC3/SCK/SCL) ; also sheet 9
GND: C133.1 C134.2 C135.2 CX136.2 CX137.2 ICP1.7(P:GND) LD103.P$2(P$2K) MPX101.GND1(GND) MPX101.GND2 MPX102.GND1(GND) MPX102.GND2 PIC101.6(VSS) PIC101.29(VSS) R1033.1 R1035.1 R1036.1 ; also sheet 2,3,4,5,6,8,9,10
LIVE_SIGN: PIC101.2(RD4/PSP4) ; also sheet 9
MAIN_CURRENT_METER: PIC101.21(RA2/AN2/VREF-) ; also sheet 6
MAIN_LINE: PIC101.38(RD0/PSP0) ; also sheet 4
MAIN_POWER_RX: PIC101.44(RC6/TX/CK) ; also sheet 9
MAIN_POWER_TX: PIC101.1(RC7/RX/DT) ; also sheet 9
MCRL: PIC101.18(MCLR*/VPP) R1032.2 ; also sheet 9
MISSION_CURRENT_METER: PIC101.22(RA3/AN3/VREF+) ; also sheet 6
MISSION_LINE: ICP1.1(A:I0) ICP1.2(A:I1) PIC101.39(RD1/PSP1) R1033.2
MISSION_LINE_N: ICP1.3(A:O) ; also sheet 4
MLPXIN_A: MPX101.DA MPX102.DA PIC101.19(RA0/AN0)
MLPXIN_B: MPX101.DB MPX102.DB PIC101.20(RA1/AN1)
MLXEN1/PGM: MPX102.EN PIC101.11(RB3/PGM) ; also sheet 9
MLXEN2: MPX101.EN PIC101.14(RB4)
MLXSW0: MPX101.A0 MPX102.A0 PIC101.8(RB0/INT)
MLXSW1: MPX101.A1 MPX102.A1 PIC101.9(RB1)
MLXSW2: MPX101.A2 MPX102.A2 PIC101.10(RB2)
N$52: CX136.1 PIC101.30(OSC1/CLKIN) XTL101.P$1
N$57: CX137.1 PIC101.31(OSC2/CLKOUT) XTL101.P$2
N$58: LD103.P$1(P$1A) R1031.1
P_PANEL_TOT_VOL: MPX101.S3B ; also sheet 6
PGC: PIC101.16(RB6/PGC) ; also sheet 9
PGD: PIC101.17(RB7/PGD) ; also sheet 9
PIC_LI_VOL_AMP: MPX102.S7B ; also sheet 6
PIC_VOL_BUS_AMP: MPX102.S8B ; also sheet 6
RSSI: MPX101.S2B ; also sheet 9
RX_LINE: PIC101.42(RC4/SDI/SDA) ; also sheet 4
TX_LINE: ICP1.4(B:I0) ICP1.5(B:I1) PIC101.43(RC5/SDO) R1034.2
TX_LINE_N: ICP1.6(B:O) ; also sheet 4
Unconnected: MPX101.NC1(NC2) MPX101.NC2(NC3) MPX101.NC(NC1) MPX101.S1A MPX101.S1B MPX101.S2A MPX101.S3A MPX101.S4A MPX101.S5A MPX101.S6A MPX101.S7A MPX101.S8A MPX102.NC1(NC2) MPX102.NC2(NC3) MPX102.NC(NC1) PIC101.15(RB5) PIC101.23(RA4/T0CKI)

## Sheet 8 of 10
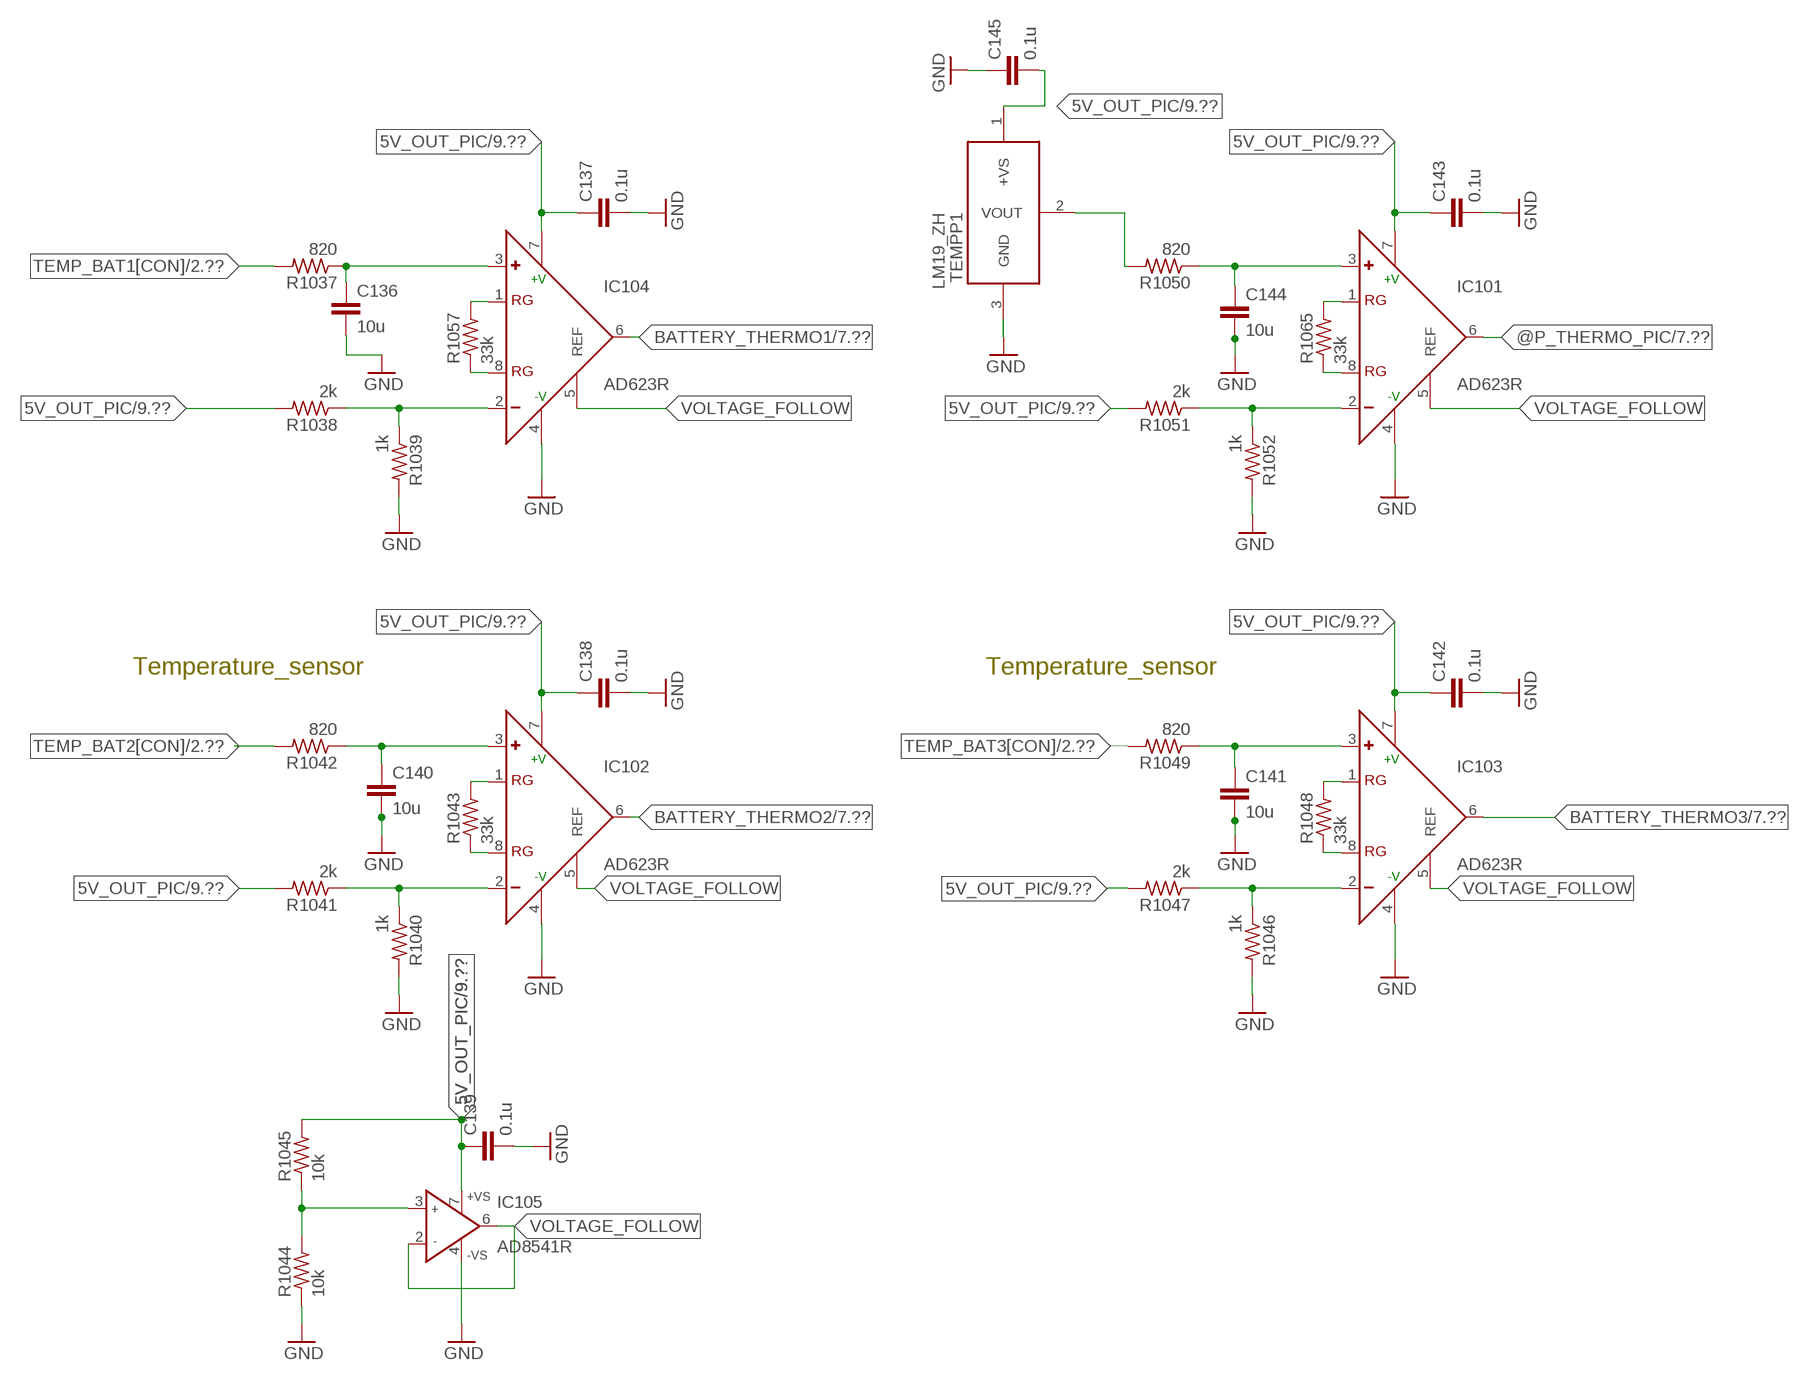
[diagram p7: schematic, sheet 8]

### Parts
C136  10u  C-EUC0603  [C0603]
C137  0.1u  C-EUC0603  [C0603]
C138  0.1u  C-EUC0603  [C0603]
C139  0.1u  C-EUC0603  [C0603]
C140  10u  C-EUC0603  [C0603]
C141  10u  C-EUC0603  [C0603]
C142  0.1u  C-EUC0603  [C0603]
C143  0.1u  C-EUC0603  [C0603]
C144  10u  C-EUC0603  [C0603]
C145  0.1u  C-EUC0603  [C0603]
IC101  AD623R  [SO8]
IC102  AD623R  [SO8]
IC103  AD623R  [SO8]
IC104  AD623R  [SO8]
IC105  AD8541R  [SO8]
R1037  820  R-US_R0603  [R0603]
R1038  2k  R-US_R0603  [R0603]
R1039  1k  R-US_R0603  [R0603]
R1040  1k  R-US_R0603  [R0603]
R1041  2k  R-US_R0603  [R0603]
R1042  820  R-US_R0603  [R0603]
R1043  33k  R-US_R0603  [R0603]
R1044  10k  R-US_R0603  [R0603]
R1045  10k  R-US_R0603  [R0603]
R1046  1k  R-US_R0603  [R0603]
R1047  2k  R-US_R0603  [R0603]
R1048  33k  R-US_R0603  [R0603]
R1049  820  R-US_R0603  [R0603]
R1050  820  R-US_R0603  [R0603]
R1051  2k  R-US_R0603  [R0603]
R1052  1k  R-US_R0603  [R0603]
R1057  33k  R-US_R0603  [R0603]
R1065  33k  R-US_R0603  [R0603]
TEMPP1  LM19_ZH  [LM19_XH]

### Nets
5V_OUT_PIC: C137.1 C138.1 C139.1 C142.1 C143.1 C145.2 IC101.7(+V) IC102.7(+V) IC103.7(+V) IC104.7(+V) IC105.7(+VS) R1038.2 R1041.2 R1045.2 R1047.2 R1051.2 TEMPP1.1(+VS) ; also sheet 2,4,6,7,9
@P_THERMO_PIC: IC101.6(OUT) ; also sheet 7
BATTERY_THERMO1: IC104.6(OUT) ; also sheet 7
BATTERY_THERMO2: IC102.6(OUT) ; also sheet 7
BATTERY_THERMO3: IC103.6(OUT) ; also sheet 7
GND: C136.2 C137.2 C138.2 C139.2 C140.2 C141.2 C142.2 C143.2 C144.2 C145.1 IC101.4(-V) IC102.4(-V) IC103.4(-V) IC104.4(-V) IC105.4(-VS) R1039.2 R1040.2 R1044.1 R1046.2 R1052.2 TEMPP1.3(GND) ; also sheet 2,3,4,5,6,7,9,10
N$11: R1050.2 TEMPP1.2(VOUT)
N$49: IC105.3(IN+) R1044.2 R1045.1
N$59: C141.1 IC103.3(+) R1049.1
N$60: IC103.1(RG) R1048.2
N$66: IC103.8(RG) R1048.1
N$67: IC103.2(-) R1046.1 R1047.1
N$73: C144.1 IC101.3(+) R1050.1
N$74: IC101.1(RG) R1065.2
N$78: IC101.8(RG) R1065.1
N$79: IC101.2(-) R1051.1 R1052.1
N$83: C140.1 IC102.3(+) R1042.1
N$84: IC102.1(RG) R1043.2
N$85: IC102.8(RG) R1043.1
N$86: IC102.2(-) R1040.1 R1041.1
N$93: C136.1 IC104.3(+) R1037.1
N$94: IC104.1(RG) R1057.2
N$95: IC104.8(RG) R1057.1
N$99: IC104.2(-) R1038.1 R1039.1
TEMP_BAT1[CON]: R1037.2 ; also sheet 2
TEMP_BAT2[CON]: R1042.2 ; also sheet 2
TEMP_BAT3[CON]: R1049.2 ; also sheet 2
VOLTAGE_FOLLOW: IC101.5(REF) IC102.5(REF) IC103.5(REF) IC104.5(REF) IC105.2(IN-) IC105.6(OUT)

### Notes on the sheet
- Temperature_sensor | Temperature_sensor

## Sheet 9 of 10
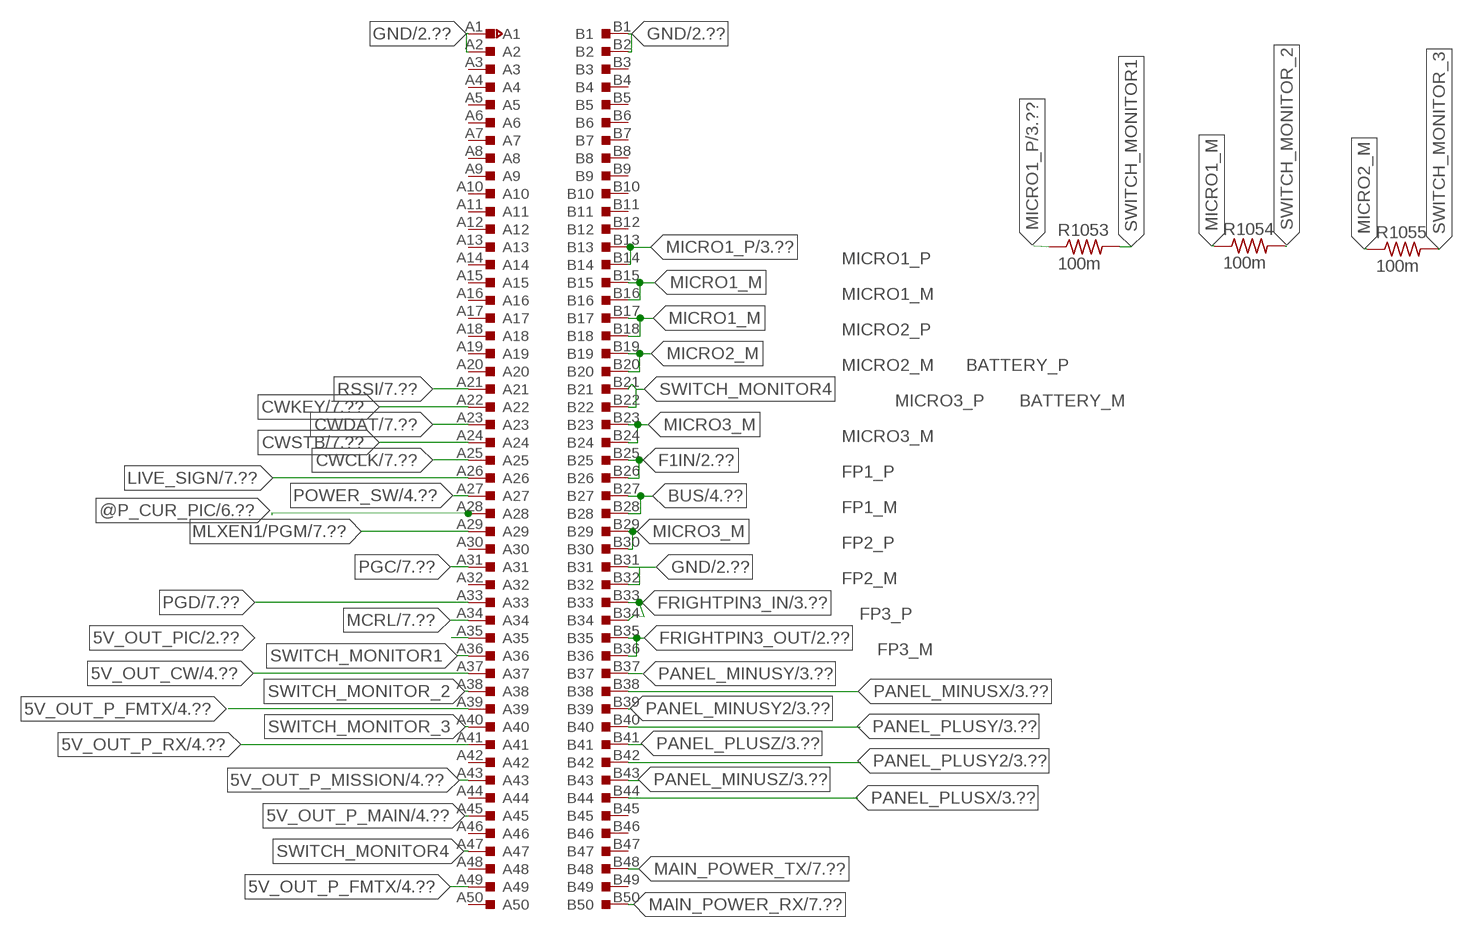
[diagram p8: schematic, sheet 9]

### Parts
HCONP  XH3B-013P-D5F_NEW  [XH3B-013P-D5F]
R1053  100m  R-US_R1206  [R1206]
R1054  100m  R-US_R1206  [R1206]
R1055  100m  R-US_R1206  [R1206]

### Nets
5V_OUT_CW: HCONP.A37 ; also sheet 4
5V_OUT_P_FMTX: HCONP.A39 HCONP.A49 ; also sheet 4
5V_OUT_P_MAIN: HCONP.A45 ; also sheet 4
5V_OUT_P_MISSION: HCONP.A43 ; also sheet 4
5V_OUT_P_RX: HCONP.A41 ; also sheet 4
5V_OUT_PIC: HCONP.A35 ; also sheet 2,4,6,7,8
@P_CUR_PIC: HCONP.A28 ; also sheet 6,7
BUS: HCONP.B27 HCONP.B28 ; also sheet 4
CWCLK: HCONP.A25 ; also sheet 7
CWDAT: HCONP.A23 ; also sheet 7
CWKEY: HCONP.A22 ; also sheet 7
CWSTB: HCONP.A24 ; also sheet 7
F1IN: HCONP.B25 HCONP.B26 ; also sheet 2
FRIGHTPIN3_IN: HCONP.B33 HCONP.B34 ; also sheet 3
FRIGHTPIN3_OUT: HCONP.B35 HCONP.B36 ; also sheet 2,6
GND: HCONP.A1 HCONP.A2 HCONP.B1 HCONP.B2 HCONP.B31 HCONP.B32 ; also sheet 2,3,4,5,6,7,8,10
LIVE_SIGN: HCONP.A26 ; also sheet 7
MAIN_POWER_RX: HCONP.B50 ; also sheet 7
MAIN_POWER_TX: HCONP.B48 ; also sheet 7
MCRL: HCONP.A34 ; also sheet 7
MICRO1_M: HCONP.B15 HCONP.B16 HCONP.B17 HCONP.B18 R1054.1
MICRO1_P: HCONP.B13 HCONP.B14 R1053.1 ; also sheet 3
MICRO2_M: HCONP.B19 HCONP.B20 R1055.1
MICRO3_M: HCONP.B23 HCONP.B24 HCONP.B29 HCONP.B30
MLXEN1/PGM: HCONP.A29 ; also sheet 7
PANEL_MINUSX: HCONP.B38 ; also sheet 3
PANEL_MINUSY: HCONP.B37 ; also sheet 3
PANEL_MINUSY2: HCONP.B39 ; also sheet 3
PANEL_MINUSZ: HCONP.B43 ; also sheet 3
PANEL_PLUSX: HCONP.B44 ; also sheet 3
PANEL_PLUSY: HCONP.B40 ; also sheet 3
PANEL_PLUSY2: HCONP.B42 ; also sheet 3
PANEL_PLUSZ: HCONP.B41 ; also sheet 3
PGC: HCONP.A31 ; also sheet 7
PGD: HCONP.A33 ; also sheet 7
POWER_SW: HCONP.A27 ; also sheet 4
RSSI: HCONP.A21 ; also sheet 7
SWITCH_MONITOR1: HCONP.A36 R1053.2
SWITCH_MONITOR4: HCONP.A47 HCONP.B21 HCONP.B22
SWITCH_MONITOR_2: HCONP.A38 R1054.2
SWITCH_MONITOR_3: HCONP.A40 R1055.2
Unconnected: HCONP.A3 HCONP.A4 HCONP.A5 HCONP.A6 HCONP.A7 HCONP.A8 HCONP.A9 HCONP.A10 HCONP.A11 HCONP.A12 HCONP.A13 HCONP.A14 HCONP.A15 HCONP.A16 HCONP.A17 HCONP.A18 HCONP.A19 HCONP.A20 HCONP.A30 HCONP.A32 HCONP.A42 HCONP.A44 HCONP.A46 HCONP.A48 HCONP.A50 HCONP.B3 HCONP.B4 HCONP.B5 HCONP.B6 HCONP.B7 HCONP.B8 HCONP.B9 HCONP.B10 HCONP.B11 HCONP.B12 HCONP.B45 HCONP.B46 HCONP.B47 HCONP.B49

### Notes on the sheet
- MICRO1_P
- MICRO1_M
- MICRO2_P
- MICRO2_M | BATTERY_P
- MICRO3_P | BATTERY_M
- MICRO3_M
- FP1_P
- FP1_M
- FP2_P
- FP2_M
- FP3_P
- FP3_M

## Sheet 10 of 10
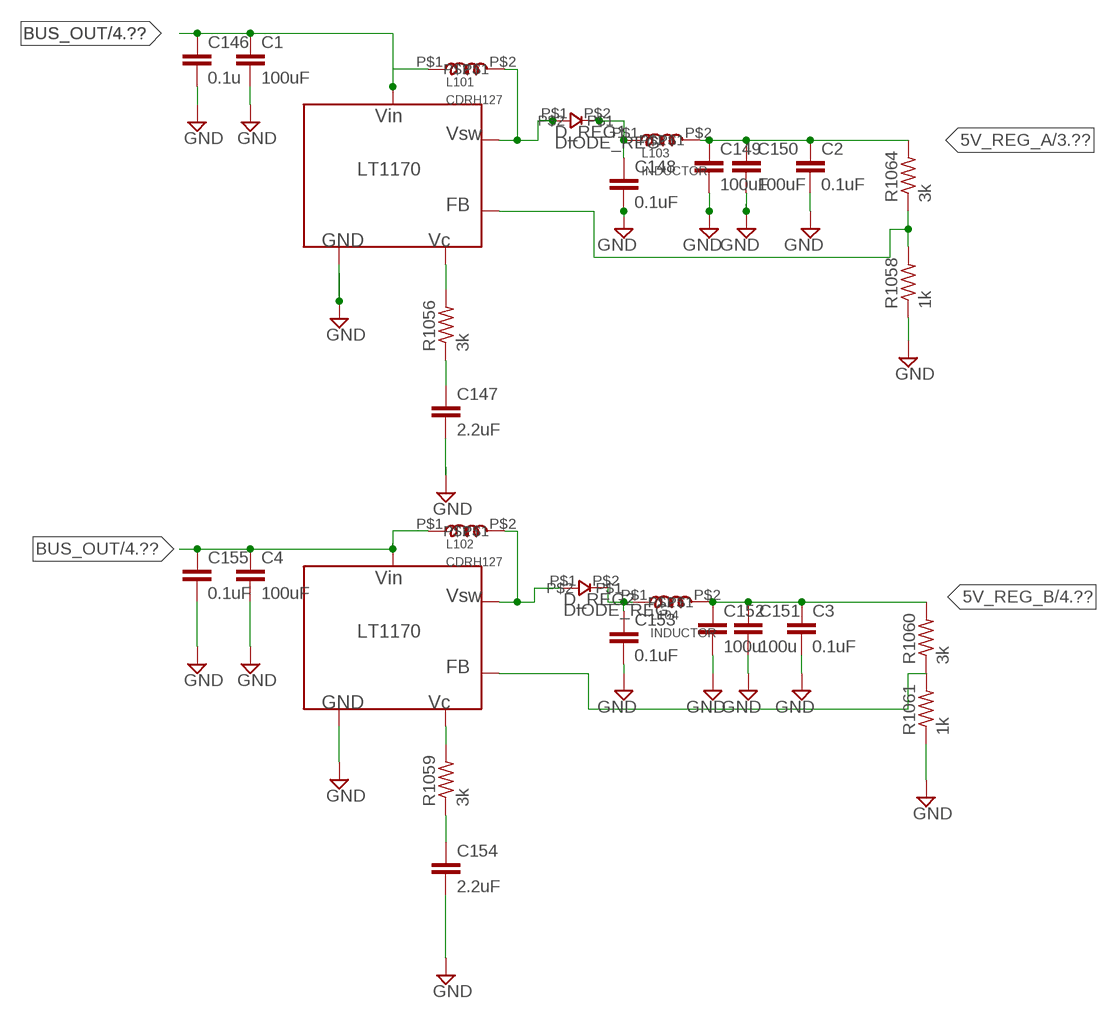
[diagram p9: schematic, sheet 10]

### Parts
C1  100uF  C-EUC1210  [C1210]
C2  0.1uF  C-EUC0603  [C0603]
C3  0.1uF  C-EUC0603  [C0603]
C4  100uF  C-EUC1210  [C1210]
C146  0.1u  C-EUC0603  [C0603]
C147  2.2uF  C-EUC0603  [C0603]
C148  0.1uF  C-EUC0603  [C0603]
C149  100uF  C-EUC1210  [C1210]
C150  100uF  C-EUC1210  [C1210]
C151  100u  C-EUC1210  [C1210]
C152  100u  C-EUC1210  [C1210]
C153  0.1uF  C-EUC0603  [C0603]
C154  2.2uF  C-EUC0603  [C0603]
C155  0.1uF  C-EUC0603  [C0603]
D_REG1  DIODE_REG  [DIO]
D_REG2  DIODE_REG  [DIO]
L101  CDRH127  [CDRH127]
L102  CDRH127  [CDRH127]
L103  INDUCTOR  [IN]
L104  INDUCTOR  [IN]
R1056  3k  R-US_R0603  [R0603]
R1058  1k  R-US_R0603  [R0603]
R1059  3k  R-US_R0603  [R0603]
R1060  3k  R-US_R0603  [R0603]
R1061  1k  R-US_R0603  [R0603]
R1064  3k  R-US_R0603  [R0603]
REGP1  LT1170  [LT1170]
REGP2  LT1170  [LT1170]

### Nets
5V_REG_A: C2.1 C149.1 C150.1 L103.P$2 R1064.2 ; also sheet 3,4,5,6,7
5V_REG_B: C3.1 C151.1 C152.1 L104.P$2 R1060.2 ; also sheet 4
BUS_OUT: C1.1 C4.1 C146.1 C155.1 L101.P$1 L102.P$1 REGP1.VIN:5 REGP2.VIN:5 ; also sheet 4
GND: C1.2 C2.2 C3.2 C4.2 C146.2 C147.2 C148.2 C149.2 C150.2 C151.2 C152.2 C153.2 C154.2 C155.2 R1058.1 R1061.1 REGP1.GND:3 REGP2.GND:3 ; also sheet 2,3,4,5,6,7,8,9
N$1: D_REG1.P$1 L101.P$2 REGP1.VSW:4
N$18: C148.1 D_REG1.P$2 L103.P$1
N$25: R1056.2 REGP1.VC:1
N$26: C147.1 R1056.1
N$34: D_REG2.P$1 L102.P$2 REGP2.VSW:4
N$35: C153.1 D_REG2.P$2 L104.P$1
N$39: R1059.2 REGP2.VC:1
N$40: C154.1 R1059.1
PIC_VOL_REGA: R1058.2 R1064.1 REGP1.FB:2
PIC_VOL_REGB: R1060.1 R1061.2 REGP2.FB:2

## Library data of the parts
AMP101-AMP106 = 03_Amp:AD8554ARUZ
BCNP3 = pinhead:PINHD-1X2: PIN HEADER
BCNP4-BCNP6 = BatteryConector:BAT_CON1
BT101 = mitalib:2SA1425: Silicon PNP Transistor Toshiba Semiconductor VCBO=-120V, IC=-800mA, PC=1000mW hFE=80-240
C1 C4 C5 C146 C147 C149-C152 C154 C155 = mylib:C-EU: CAPACITOR, European symbol
C2 C3 C101-C108 C110-C124 C126 C128-C145 C148 C153 = 05mylib:C-EU: CAPACITOR, European symbol
CHARGE_IC = artsat:MM1639
CX136 CX137 = rcl:C-EU: CAPACITOR, European symbol
D101-D112 D114-D117 = 00diode2:DIODE_FM
D_REG1 D_REG2 = 00diode_reg:DIODE_REG
HCONP = habconector20120702:XH3B-013P-D5F_NEW: OMRON HabConnector XH3B-013P-D5F 2012-07-02
IC101-IC104 = analog-devices:AD623: Single-Supply, Rail-to-Rail, Low Cost Instrumentation Amplifier Source: http://www.analog.com/static/imported-files/data_sheets/AD623.pdf; MPN: AD623ARZ.; OC_FARNELL: 9426213; OC_NEWARK: 31M4186
IC105 = analog-devices:AD8541: General-Purpose CMOS Rail-to-Rail Amplifiers Source: http://www.analog.com/static/imported-files/data_sheets/AD8541_8542_8544.pdf; MPN: AD8541ARZ; OC_FARNELL: 9603859; OC_NEWARK: 31M4547
ICP1 = 74xx-eu:74*00: Quad 2-input NAND gate
L101 L102 = 00new_inductor:CDRH127
L103 L104 = 00new_inductor:INDUCTOR
LD101 LD102 = led:LED: LED OSRAM: - CHIPLED LG R971, LG N971, LY N971, LG Q971, LY Q971, LO R971, LY R971 LH N974, LH R974 LS Q976, LO Q976, LY Q976 LO Q996 - Hyper CHIPLED LW Q18S LB Q993, LB Q99A, LB R99A - SideLED LS A670, LO A670, LY A670, LG A670, LP A670 LB A673, LV A673, LT A673, LW A673 LH A674 LY A675 LS A676, LA A676, LO A676, LY A676, LW A676 LS A679, LY A679, LG A679 - Hyper Micro SIDELED® LS Y876, LA Y876, LO Y876, LY Y876 LT Y87S - SmartLED LW L88C, LW L88S LB L89C, LB L89S, LG L890 LS L89K, LO L89K, LY L89K LS L896, LA L896, LO L896, LY L896 - TOPLED LS T670, LO T670, LY T670, LG T670, LP T670 LSG T670, LSP T670, LSY T670, LOP T670, LYG T670 LG T671, LOG T671, LSG T671 LB T673, LV T673, LT T673, LW T673 LH T674 LS T676, LA T676, LO T676, LY T676, LB T676, LH T676, LSB T676, LW T676 LB T67C, LV T67C, LT T67C, LS T67K, LO T67K, LY T67K, LW E67C LS E67B, LA E67B, LO E67B, LY E67B, LB E67C, LV E67C, LT E67C LW T67C LS T679, LY T679, LG T679 LS T770, LO T770, LY T770, LG T770, LP T770 LB T773, LV T773, LT T773, LW T773 LH T774 LS E675, LA E675, LY E675, LS T675 LS T776, LA T776, LO T776, LY T776, LB T776 LHGB T686 LT T68C, LB T68C - Hyper Mini TOPLED® LB M676 - Mini TOPLED Santana® LG M470 LS M47K, LO M47K, LY M47K Source: http://www.osram.convergy.de LUXEON: - LUMILED® LXK2-PW12-R00, LXK2-PW12-S00, LXK2-PW14-U00, LXK2-PW14-V00 LXK2-PM12-R00, LXK2-PM12-S00, LXK2-PM14-U00 LXK2-PE12-Q00, LXK2-PE12-R00, LXK2-PE12-S00, LXK2-PE14-T00, LXK2-PE14-U00 LXK2-PB12-K00, LXK2-PB12-L00, LXK2-PB12-M00, LXK2-PB14-N00, LXK2-PB14-P00, LXK2-PB14-Q00 LXK2-PR12-L00, LXK2-PR12-M00, LXK2-PR14-Q00, LXK2-PR14-R00 LXK2-PD12-Q00, LXK2-PD12-R00, LXK2-PD12-S00 LXK2-PH12-R00, LXK2-PH12-S00 LXK2-PL12-P00, LXK2-PL12-Q00, LXK2-PL12-R00 Source: www.luxeon.com KINGBRIGHT: KA-3528ASYC Source: www.kingbright.com
LD103 = 02LED_CHIp:SML-21X
LI M_X M_Y M_Y" M_Z P_CW P_H8 P_HTR P_MISSION P_PIC P_REG P_RX P_TX P_X P_Y P_Y" P_Z TOT = 03_Amp:MAX4172: ARTSAT Amp
MPX101 MPX102 = ADG707:ADG707
PIC101 = pic16f87x:PIC16F877: FLASH MICROCONTROLLER
Q101 Q102 = artsat:2SK1062
Q103-Q107 Q109 Q110 QP08 = 03_Amp:2SJ377: P-MOS FET for ARTSAT
R101-R103 R107-R110 R1031-R1038 R1041-R1045 R1047-R1051 R1053-R1061 R1064 R1065 = mylib:R-US_: RESISTOR, American symbol
R105 R106 R1039 R1040 R1046 R1052 RP04 = 05mylib:R-US_: RESISTOR, American symbol
R1011 R1013-R1029 R1062 R1063 R1066 RP012 = rcl:R-EU_: RESISTOR, European symbol
REGP1 REGP2 = 02_Regulator:LT1170: LT1170CT
SR101-SR136 = 00shunt:SHUNT_10M
TEMPP1 = LM19_ZH:LM19_ZH: LM19 + Connector(JST XH)
XTL101 = 00hassinsi_20MHz:NX8045GB